# Altium project Telem.PrjPCB
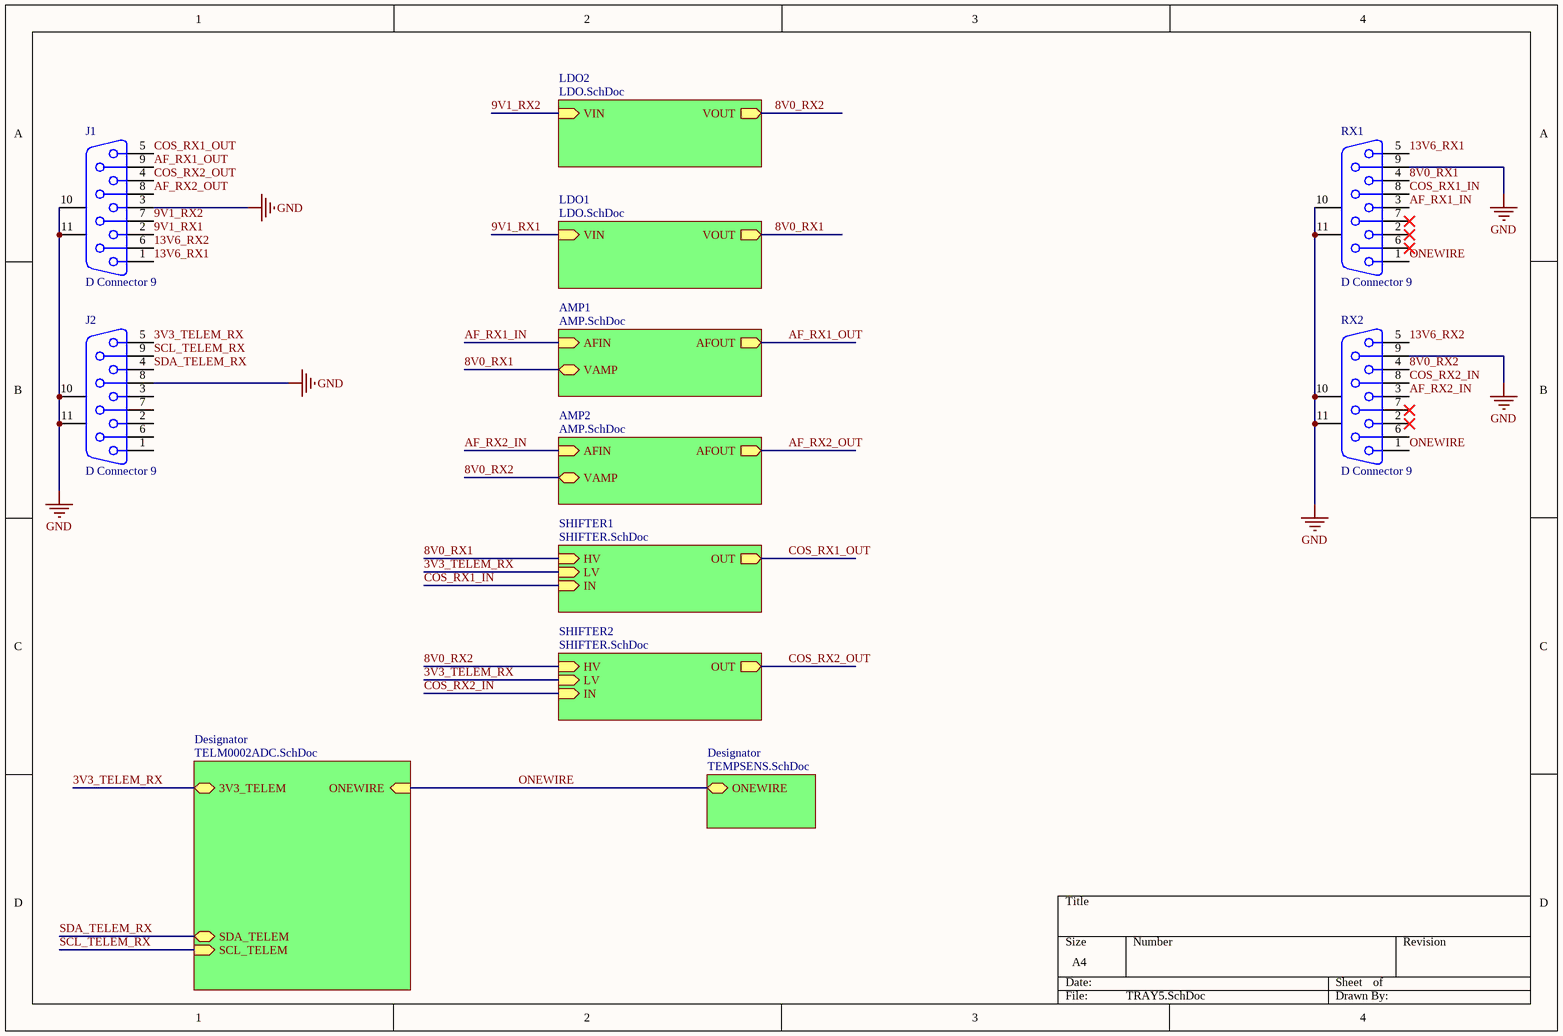
[diagram p0: TRAY5.SchDoc]
5 sheets, 43 parts. Net scope: hierarchical (ports join the sheet entries above them; power ports are global).
Board file: TRAY5.PcbDoc
Sheets:
  TRAY5.SchDoc
    Designator = TELM0002ADC.SchDoc
    Designator = TEMPSENS.SchDoc
    LDO2 = LDO.SchDoc
    LDO1 = LDO.SchDoc
    AMP1 = AMP.SchDoc
    AMP2 = AMP.SchDoc

## Sheet TRAY5.SchDoc
size A4

### Parts
J1  D Connector 9  [DSUB1.385-2H9]
J2  D Connector 9  [DSUB1.385-2H9]
RX1  D Connector 9  [DSUB Upright]
RX2  D Connector 9  [DSUB Upright]

### Sub-sheets
AMP1 = AMP.SchDoc: AFIN (in), AFOUT (out), VAMP
AMP2 = AMP.SchDoc: AFIN (in), AFOUT (out), VAMP
Designator = TELM0002ADC.SchDoc: SDA_TELEM (bidir), SCL_TELEM (in), ONEWIRE (in), 3V3_TELEM
Designator = TEMPSENS.SchDoc: ONEWIRE (bidir)
LDO1 = LDO.SchDoc: VOUT (out), VIN (in)
LDO2 = LDO.SchDoc: VOUT (out), VIN (in)
SHIFTER1 = SHIFTER.SchDoc (file not in this document): HV (in), LV (in), IN (in), OUT (out)
SHIFTER2 = SHIFTER.SchDoc (file not in this document): HV (in), LV (in), IN (in), OUT (out)

### Nets
3V3_TELEM_RX: J2.5 ; sheet Designator/3V3_TELEM, sheet SHIFTER1/LV, sheet SHIFTER2/LV
GND: J1.3 J1.10(MH1) J1.11(MH2) J2.8 J2.10(MH1) J2.11(MH2) RX1.9 RX1.10(MH1) RX1.11(MH2) RX2.9 RX2.10(MH1) RX2.11(MH2)
8V0_RX1: RX1.4 ; sheet LDO1/VOUT, sheet AMP1/VAMP, sheet SHIFTER1/HV
8V0_RX2: RX2.4 ; sheet LDO2/VOUT, sheet AMP2/VAMP, sheet SHIFTER2/HV
9V1_RX1: J1.2 ; sheet LDO1/VIN
9V1_RX2: J1.7 ; sheet LDO2/VIN
13V6_RX1: J1.1 RX1.5
13V6_RX2: J1.6 RX2.5
AF_RX1_IN: RX1.3 ; sheet AMP1/AFIN
AF_RX1_OUT: J1.9 ; sheet AMP1/AFOUT
AF_RX2_IN: RX2.3 ; sheet AMP2/AFIN
AF_RX2_OUT: J1.8 ; sheet AMP2/AFOUT
COS_RX1_IN: RX1.8 ; sheet SHIFTER1/IN
COS_RX1_OUT: J1.5 ; sheet SHIFTER1/OUT
COS_RX2_IN: RX2.8 ; sheet SHIFTER2/IN
COS_RX2_OUT: J1.4 ; sheet SHIFTER2/OUT
ONEWIRE: RX1.1 RX2.1 ; sheet Designator/ONEWIRE, sheet Designator/ONEWIRE
SCL_TELEM_RX: J2.9 ; sheet Designator/SCL_TELEM
SDA_TELEM_RX: J2.4 ; sheet Designator/SDA_TELEM

Not connected (* = marked no-connect by the designer): J2 1 2 3 6 7; RX1 2* 6* 7*; RX2 2* 6 7*

### Library data of the parts
J1 J2 = D Connector 9: Receptacle Assembly, 9 Position, Right Angle; Supplier: Digikey; Supplier P/N: A35109-ND
RX1 RX2 = D Connector 9: Receptacle Assembly, 9 Position, Upright; Supplier: Digikey; Supplier P/N: A34072-ND

## Sheet TELM0002ADC.SchDoc: MAX127 Telemetry Circuit
size A3; Engineer: A. SHAW; Organization: BLUEsat Project; Address1: Room 419; Address2: School of EE&T; Address3: UNSW, NSW 2052; Address4: Australia; DocumentNumber: TELM0002; SheetNumber: 1; SheetTotal: 1; Description: Telemetry ADC Circuit; Version: 1.0
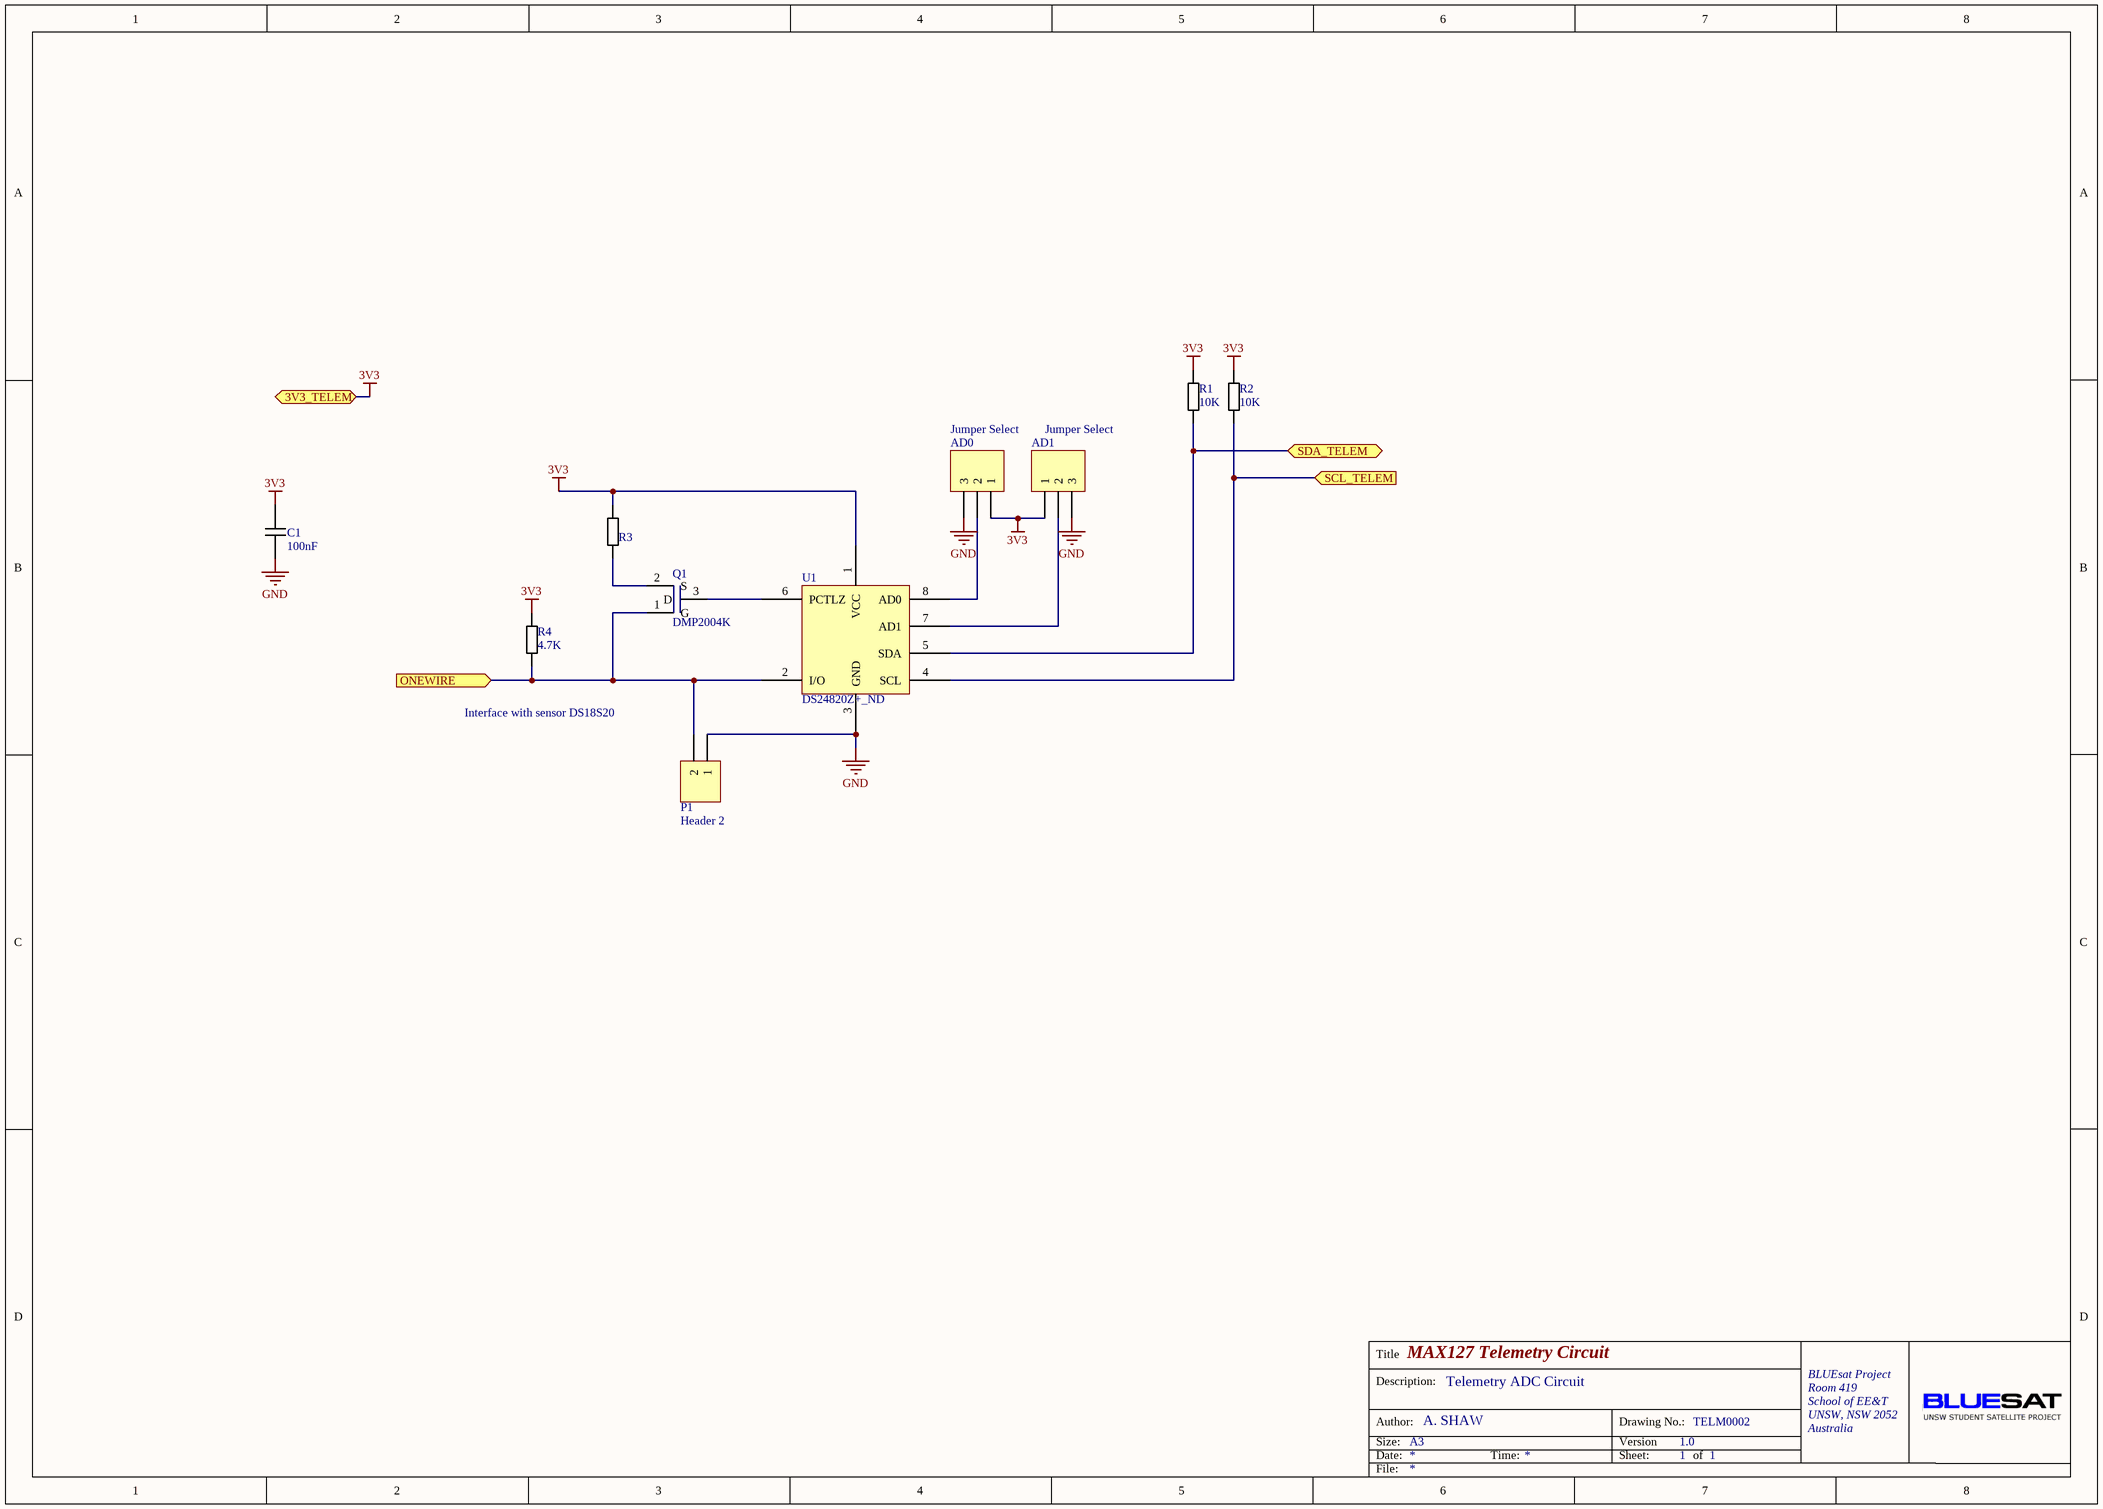
[diagram p1: TELM0002ADC.SchDoc]

### Parts
AD0  Jumper Select  [SOLDER_JUMPER_3_A]  (no BOM)
AD1  Jumper Select  [SOLDER_JUMPER_3_A]  (no BOM)
C1  value 100nF  [0805 Cap]  (hidden comment: 0805 Cap)
P1  Header 2  [HDR1X2]
Q1  DMP2004K  [DMP2004KDITR-ND]
R1  value 10K  [0805 Resistor]  (hidden comment: 0805 Resistor)
R2  value 10K  [0805 Resistor]  (hidden comment: 0805 Resistor)
R3  PTC Fuse  [0805 Resistor]  (value not drawn)
R4  value 4.7K  [0805 Resistor]  (hidden comment: 0603 Resistor)
U1  DS24820Z+_ND  [DS2482-100]

### Ports
3V3_TELEM, ONEWIRE (in), SCL_TELEM (in), SDA_TELEM (bidir)

### Nets
3V3: AD0.1 AD1.1 C1.2 R1.2 R2.2 R3.2 R4.2 U1.1(VCC) ; port 3V3_TELEM  [project net 3V3_TELEM_RX]
GND: AD0.3 AD1.3 C1.1 P1.1 U1.3(GND)
ONEWIRE: P1.2 Q1.1(G) R4.1 U1.2(I/O) ; port ONEWIRE
SCL_TELEM_RX: R2.1 U1.4(SCL) ; port SCL_TELEM
SDA_TELEM_RX: R1.1 U1.5(SDA) ; port SDA_TELEM
NetAD0_2: AD0.2 U1.8(AD0)
NetAD1_2: AD1.2 U1.7(AD1)
NetQ1_2: Q1.2(S) R3.1
NetQ1_3: Q1.3(D) U1.6(PCTLZ)

### Notes on the sheet
- Interface with sensor DS18S20
- Title
- Description:
- Size:
- Author:
- Date:
- A3
- Time:
- Version
- Sheet:
- Drawing No.:
- of
- File:

### Library data of the parts
AD0 AD1 = Header 3: Header, 3-Pin; Supplier: Digikey
C1 = 0805 MLCC - X7R, 10%: Supplier: Digikey; Supplier P/N: 445-7534-1-ND
P1 = Header 2: Header, 2-Pin; Supplier: Digikey; Supplier P/N: WM6440-ND
Q1 = DMP2004K: MOSFET P-CH 20V 600MA SOT23-3; Supplier: Digikey; Supplier P/N: DMP2004KDICT-ND
R1 R2 = 0805 Thick Film Resistor 1%: Supplier: Digikey; Supplier P/N: RMCF0805FT10K0CT-ND
R3 = 0805 PTC Fuse: Manufacturer: Bel Fuse Inc; Manufacturer P/N: 0ZCE0020FF2G; Value: 1.5; Supplier: Digikey; Supplier P/N: 507-1517-1-ND
R4 = 0603 Thick Film Resistor 1%: Supplier: Digikey; Supplier P/N: RMCF0805JT4K70CT-ND
U1 = DS24820Z+_ND: I2C to 1-Wire Master; Supplier: Digikey; Supplier P/N: DS2482S-100+T&RCT-ND

## Sheet TEMPSENS.SchDoc
size A4
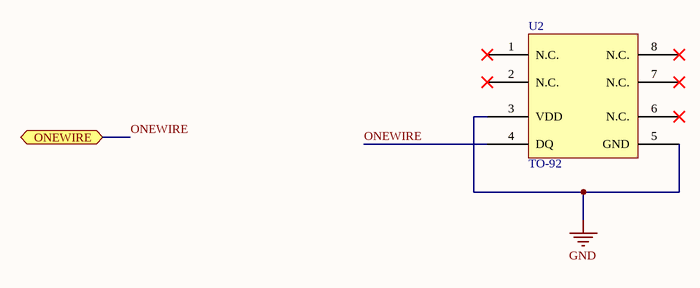
[diagram p2: TEMPSENS.SchDoc]

### Parts
U2  TO-92  [DS18S20]

### Ports
ONEWIRE (bidir)

### Nets
GND: U2.3(VDD) U2.5(GND)
ONEWIRE: U2.4(DQ) ; port ONEWIRE

Not connected (* = marked no-connect by the designer): U2 1(N.C.)* 2(N.C.)* 6(N.C.)* 7(N.C.)* 8(N.C.)*

### Library data of the parts
U2 = DS18S20: 1-Wire Digital Thermometer; Supplier: Digikey; Supplier P/N: DS18S20Z+T&RCT-ND

## Sheet LDO.SchDoc
size A4
Used 2 times, as channels LDO2, LDO1. Parts and nets are listed once, with the designators drawn on the sheet.
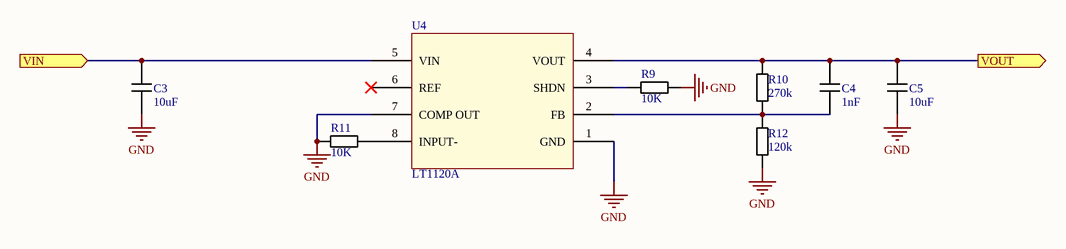
[diagram p3: LDO.SchDoc]

### Parts
C3  value 10uF  [0805 Cap]  (hidden comment: 0805 Cap)
C4  value 1nF  [0805 Cap]  (hidden comment: 0805 Cap)
C5  value 10uF  [0805 Cap]  (hidden comment: 0805 Cap)
R9  value 10K  [0805 Resistor]  (hidden comment: 0805 Resistor)
R10  value 270k  [0805 Resistor]  (hidden comment: 0805 Resistor)
R11  value 10K  [0805 Resistor]  (hidden comment: 0805 Resistor)
R12  value 120k  [0805 Resistor]  (hidden comment: 0805 Resistor)
U4  LT1120A  [SOIC8 - LT1120A]

### Ports
VIN (in), VOUT (out)

### Nets
GND: C3.1 C5.1 R9.2 R11.1 R12.1 U4.1(GND) U4.7(COMP_OUT)
VIN: C3.2 U4.5(VIN) ; port VIN
VOUT: C4.2 C5.2 R10.2 U4.4(VOUT) ; port VOUT
NetC4_1: C4.1 R10.1 R12.2 U4.2(FB)
NetR9_1: R9.1 U4.3(SHDN)
NetR11_2: R11.2 U4.8(INPUT-)

Not connected (* = marked no-connect by the designer): U4 6(REF)*

### Channels
LDO2: designators C3=C23 C4=C24 C5=C25 R9=R29 R10=R210 R11=R211 R12=R212 U4=U24; ports VIN=9V1_RX2 VOUT=8V0_RX2
LDO1: designators C3=C13 C4=C14 C5=C15 R9=R19 R10=R110 R11=R111 R12=R112 U4=U14; ports VIN=9V1_RX1 VOUT=8V0_RX1

### Library data of the parts
C3-C5 = 0805 MLCC - NP0, 5%: Supplier: Digikey
  C3 C5: Supplier P/N: JMK212AB7106KG-T
  C4: Supplier P/N: UMK212B7105KG-T
R9-R12 = 0805 Thick Film Resistor 1%: Supplier: Digikey
  R9 R11: Supplier P/N: RMCF0805FT10K0CT-ND
  R10: Supplier P/N: RC0805FR-07270KL
  R12: Supplier P/N: RC0805FR-07120KL
U4 = LT1120A: Low Dropout Regulator; Supplier: Digikey; Supplier P/N: LT1120ACS8#PBF-ND

## Sheet AMP.SchDoc
size A4
Used 2 times, as channels AMP1, AMP2. Parts and nets are listed once, with the designators drawn on the sheet.
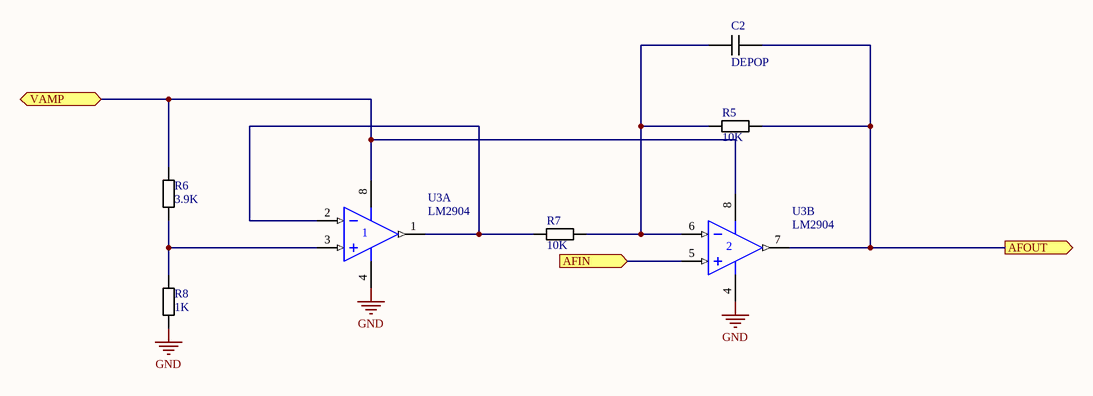
[diagram p4: AMP.SchDoc]

### Parts
C2  value DEPOP  [0805 Cap]  (hidden comment: 0805 Cap)
R5  value 10K  [0805 Resistor]  (hidden comment: 0805 Resistor)
R6  value 3.9K  [0805 Resistor]  (hidden comment: 0805 Resistor)
R7  value 10K  [0805 Resistor]  (hidden comment: 0805 Resistor)
R8  value 1K  [0805 Resistor]  (hidden comment: 0805 Resistor)
U3  LM2904  [SOIC8 - LT1120A]  (parts A,B of 2)

### Ports
AFIN (in), AFOUT (out), VAMP

### Nets
GND: R8.1 U3.4(V+)
AFIN: U3.5(IN+) ; port AFIN
AFOUT: C2.2 R5.2 U3.7(OUT) ; port AFOUT
VAMP: R6.1 U3.8(V+) ; port VAMP
NetC2_1: C2.1 R5.1 R7.2 U3.6(IN-)
NetR6_2: R6.2 R8.2 U3.3(IN+)
NetR7_1: R7.1 U3.1(OUT) U3.2(IN-)

### Channels
AMP1: designators C2=C12 R5=R15 R6=R16 R7=R17 R8=R18 U3=U13; ports AFIN=AF_RX1_IN AFOUT=AF_RX1_OUT VAMP=8V0_RX1
AMP2: designators C2=C22 R5=R25 R6=R26 R7=R27 R8=R28 U3=U23; ports AFIN=AF_RX2_IN AFOUT=AF_RX2_OUT VAMP=8V0_RX2

### Library data of the parts
C2 = 0805 MLCC - NP0, 5%
R5-R8 = 0805 Thick Film Resistor 1%
U3 = LM2904: Dual Operational Amplifier; Supplier: Element 14; Supplier P/N: 1564750

## Nets that join several sheets
3V3_TELEM_RX: TRAY5 (J2.5), TELM0002ADC (8 pins)
GND: TRAY5 (12 pins), TELM0002ADC (5 pins), TEMPSENS (U2.3 U2.5), LDO2 (7 pins), LDO1 (7 pins), AMP1 (R18.1 U13.4), AMP2 (R28.1 U23.4)
8V0_RX1: TRAY5 (RX1.4), LDO1 (C14.2 C15.2 R110.2 U14.4), AMP1 (R16.1 U13.8)
8V0_RX2: TRAY5 (RX2.4), LDO2 (C24.2 C25.2 R210.2 U24.4), AMP2 (R26.1 U23.8)
9V1_RX1: TRAY5 (J1.2), LDO1 (C13.2 U14.5)
9V1_RX2: TRAY5 (J1.7), LDO2 (C23.2 U24.5)
AF_RX1_IN: TRAY5 (RX1.3), AMP1 (U13.5)
AF_RX1_OUT: TRAY5 (J1.9), AMP1 (C12.2 R15.2 U13.7)
AF_RX2_IN: TRAY5 (RX2.3), AMP2 (U23.5)
AF_RX2_OUT: TRAY5 (J1.8), AMP2 (C22.2 R25.2 U23.7)
ONEWIRE: TRAY5 (RX1.1 RX2.1), TELM0002ADC (P1.2 Q1.1 R4.1 U1.2), TEMPSENS (U2.4)
SCL_TELEM_RX: TRAY5 (J2.9), TELM0002ADC (R2.1 U1.4)
SDA_TELEM_RX: TRAY5 (J2.4), TELM0002ADC (R1.1 U1.5)